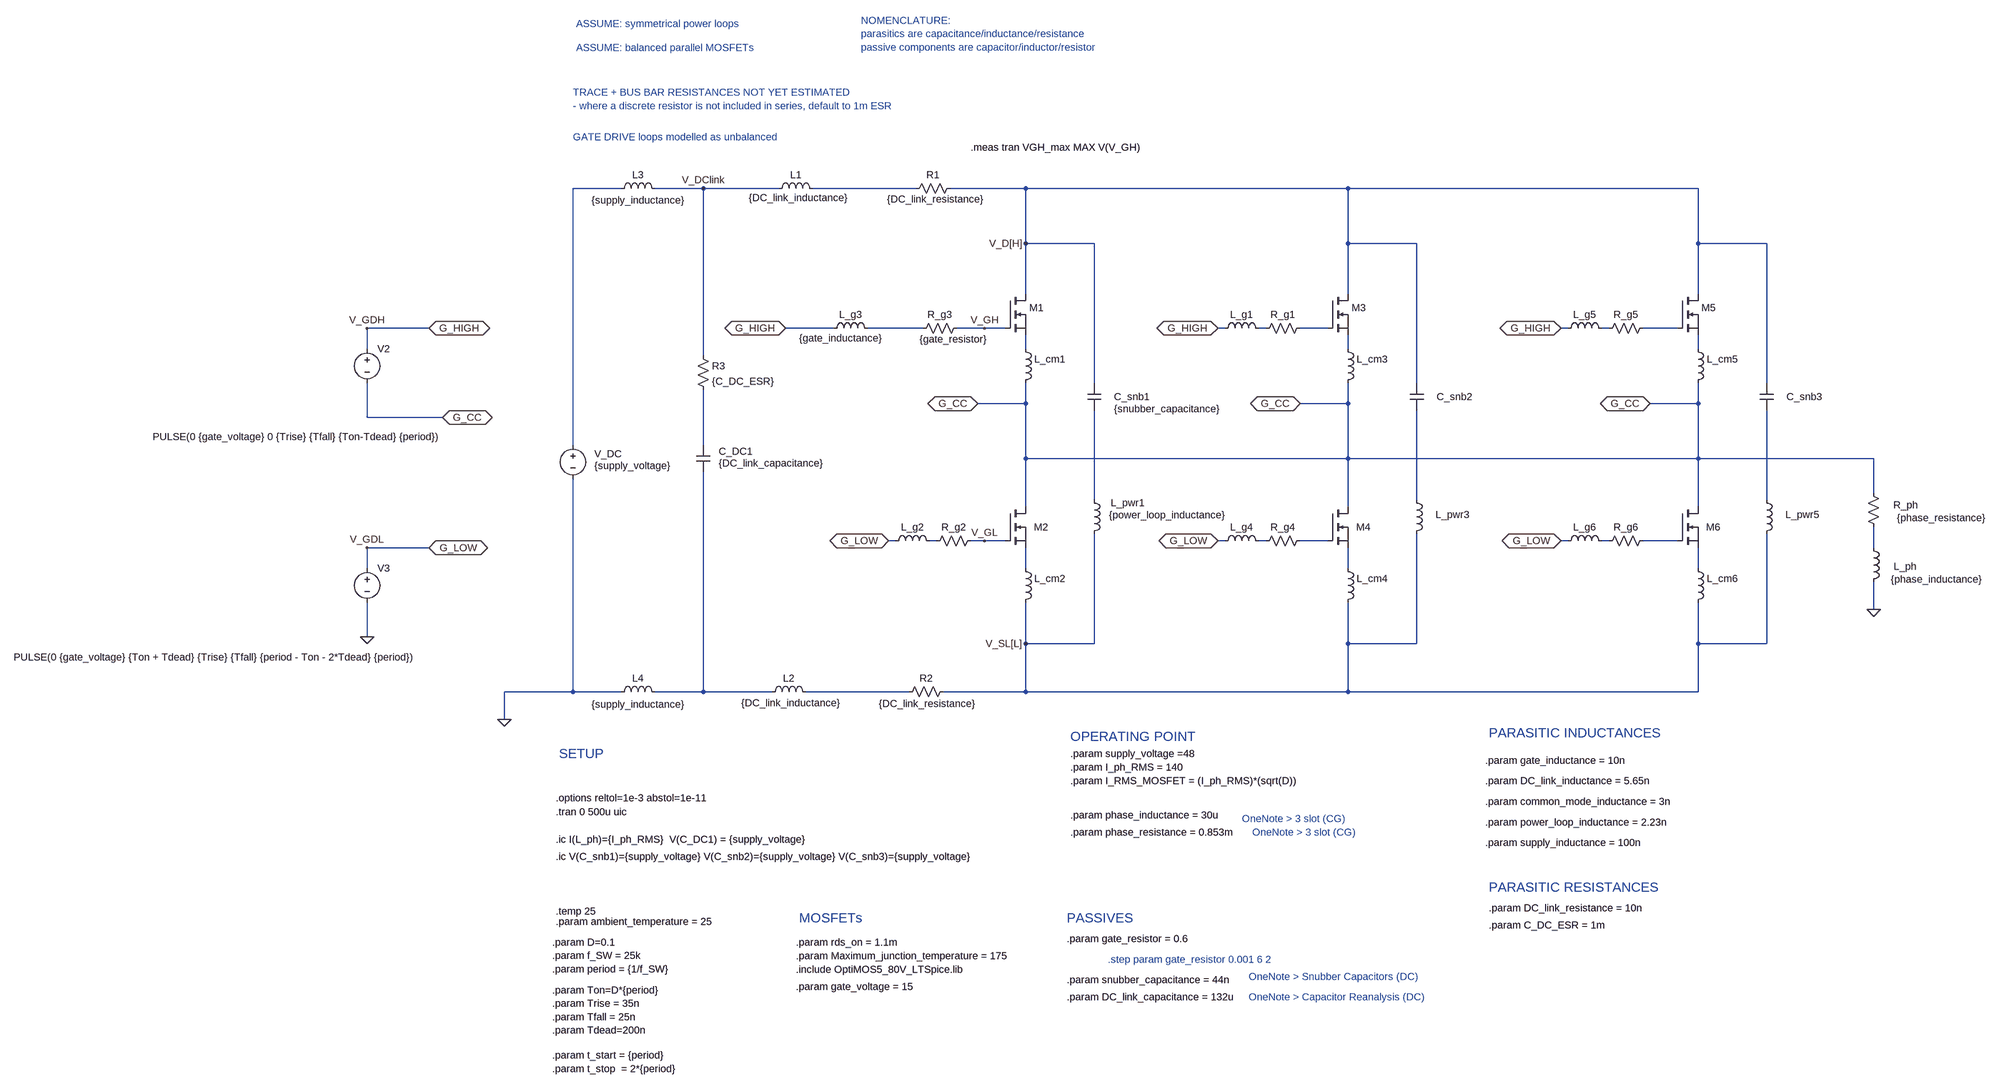
[diagram p0: schematic Inverter_UNBALANCED.asc]
Inverter_UNBALANCED.asc, the LTspice schematic file:
Version 4.1
SHEET 1 7948 3392
WIRE 1136 -928 1024 -928
WIRE 1328 -928 1216 -928
WIRE 1504 -928 1328 -928
WIRE 1824 -928 1584 -928
WIRE 2080 -928 1904 -928
WIRE 2832 -928 2080 -928
WIRE 3648 -928 2832 -928
WIRE 2080 -800 2080 -928
WIRE 2240 -800 2080 -800
WIRE 2832 -800 2832 -928
WIRE 2992 -800 2832 -800
WIRE 3648 -800 3648 -928
WIRE 3808 -800 3648 -800
WIRE 2080 -672 2080 -800
WIRE 2832 -672 2832 -800
WIRE 3648 -672 3648 -800
WIRE 688 -592 544 -592
WIRE 1632 -592 1520 -592
WIRE 1840 -592 1712 -592
WIRE 1984 -592 1920 -592
WIRE 2032 -592 1984 -592
WIRE 2080 -592 2080 -608
WIRE 2544 -592 2528 -592
WIRE 2640 -592 2624 -592
WIRE 2784 -592 2720 -592
WIRE 2832 -592 2832 -608
WIRE 3344 -592 3328 -592
WIRE 3440 -592 3424 -592
WIRE 3600 -592 3520 -592
WIRE 3648 -592 3648 -608
WIRE 544 -544 544 -592
WIRE 2080 -544 2080 -576
WIRE 2832 -544 2832 -576
WIRE 3648 -544 3648 -576
WIRE 1328 -528 1328 -928
WIRE 2240 -464 2240 -800
WIRE 2992 -464 2992 -800
WIRE 3808 -464 3808 -800
WIRE 2080 -416 2080 -464
WIRE 2080 -416 1968 -416
WIRE 2832 -416 2832 -464
WIRE 2832 -416 2720 -416
WIRE 3648 -416 3648 -464
WIRE 3648 -416 3536 -416
WIRE 544 -384 544 -464
WIRE 720 -384 544 -384
WIRE 1024 -320 1024 -928
WIRE 1328 -320 1328 -448
WIRE 2080 -288 2080 -416
WIRE 2832 -288 2832 -416
WIRE 2832 -288 2080 -288
WIRE 3648 -288 3648 -416
WIRE 3648 -288 2832 -288
WIRE 4064 -288 3648 -288
WIRE 4064 -208 4064 -288
WIRE 2240 -192 2240 -400
WIRE 2992 -192 2992 -400
WIRE 3808 -192 3808 -400
WIRE 2080 -176 2080 -288
WIRE 2832 -176 2832 -288
WIRE 3648 -176 3648 -288
WIRE 1776 -96 1760 -96
WIRE 1872 -96 1856 -96
WIRE 1984 -96 1952 -96
WIRE 2032 -96 1984 -96
WIRE 2544 -96 2528 -96
WIRE 2640 -96 2624 -96
WIRE 2784 -96 2720 -96
WIRE 3344 -96 3328 -96
WIRE 3440 -96 3424 -96
WIRE 3600 -96 3520 -96
WIRE 688 -80 544 -80
WIRE 4064 -80 4064 -128
WIRE 544 -32 544 -80
WIRE 2080 -32 2080 -80
WIRE 2832 -32 2832 -80
WIRE 3648 -32 3648 -80
WIRE 4064 64 4064 0
WIRE 544 128 544 48
WIRE 2080 144 2080 48
WIRE 2240 144 2240 -112
WIRE 2240 144 2080 144
WIRE 2832 144 2832 48
WIRE 2992 144 2992 -112
WIRE 2992 144 2832 144
WIRE 3648 144 3648 48
WIRE 3808 144 3808 -112
WIRE 3808 144 3648 144
WIRE 1024 256 1024 -240
WIRE 1024 256 864 256
WIRE 1136 256 1024 256
WIRE 1328 256 1328 -256
WIRE 1328 256 1216 256
WIRE 1488 256 1328 256
WIRE 1808 256 1568 256
WIRE 2080 256 2080 144
WIRE 2080 256 1888 256
WIRE 2832 256 2832 144
WIRE 2832 256 2080 256
WIRE 3648 256 3648 144
WIRE 3648 256 2832 256
WIRE 864 320 864 256
FLAG 544 128 0
FLAG 4064 64 0
FLAG 688 -592 G_HIGH
IOPIN 688 -592 BiDir
FLAG 688 -80 G_LOW
IOPIN 688 -80 BiDir
FLAG 1520 -592 G_HIGH
IOPIN 1520 -592 BiDir
FLAG 1760 -96 G_LOW
IOPIN 1760 -96 BiDir
FLAG 864 320 0
FLAG 1968 -416 G_CC
IOPIN 1968 -416 BiDir
FLAG 720 -384 G_CC
IOPIN 720 -384 BiDir
FLAG 2720 -416 G_CC
IOPIN 2720 -416 BiDir
FLAG 3536 -416 G_CC
IOPIN 3536 -416 BiDir
FLAG 1984 -592 V_GH
FLAG 1984 -96 V_GL
FLAG 2080 -800 V_D[H]
FLAG 2080 144 V_SL[L]
FLAG 544 -592 V_GDH
FLAG 544 -80 V_GDL
FLAG 1328 -928 V_DClink
FLAG 2528 -592 G_HIGH
IOPIN 2528 -592 BiDir
FLAG 2528 -96 G_LOW
IOPIN 2528 -96 BiDir
FLAG 3328 -592 G_HIGH
IOPIN 3328 -592 BiDir
FLAG 3328 -96 G_LOW
IOPIN 3328 -96 BiDir
SYMBOL voltage 1024 -336 R0
WINDOW 3 50 65 Left 2
WINDOW 0 50 37 Left 2
SYMATTR Value {supply_voltage}
SYMATTR InstName V_DC
SYMATTR SpiceLine Rser=0
SYMBOL cap 1312 -320 R0
WINDOW 0 52 15 Left 2
WINDOW 3 52 43 Left 2
SYMATTR InstName C_DC1
SYMATTR Value {DC_link_capacitance}
SYMATTR SpiceLine Rser=0
SYMBOL voltage 544 -560 R0
WINDOW 123 0 0 Left 0
WINDOW 39 0 0 Left 0
WINDOW 3 -500 221 Left 2
SYMATTR Value PULSE(0 {gate_voltage} 0 {Trise} {Tfall} {Ton-Tdead} {period})
SYMATTR InstName V2
SYMBOL voltage 544 -48 R0
WINDOW 123 0 0 Left 0
WINDOW 39 0 0 Left 0
WINDOW 3 -824 223 Left 2
SYMATTR Value PULSE(0 {gate_voltage} {Ton + Tdead} {Trise} {Tfall} {period - Ton - 2*Tdead} {period})
SYMATTR InstName V3
SYMBOL cap 2224 -464 R0
WINDOW 0 62 32 Left 2
WINDOW 3 62 60 Left 2
SYMATTR InstName C_snb1
SYMATTR Value {snubber_capacitance}
SYMATTR SpiceLine Rser=0
SYMBOL res 4080 -112 R180
WINDOW 0 -88 68 Left 2
WINDOW 3 -245 38 Left 2
SYMATTR InstName R_ph
SYMATTR Value {phase_resistance}
SYMBOL ind 4048 -96 R0
WINDOW 0 63 60 Left 2
WINDOW 3 56 90 Left 2
SYMATTR InstName L_ph
SYMATTR Value {phase_inductance}
SYMATTR SpiceLine Rser=1m
SYMBOL nmos 2032 -672 R0
WINDOW 3 56 72 Invisible 2
SYMATTR Value IPTG011N08NM5_L0
SYMATTR InstName M1
SYMATTR Prefix X
SYMBOL nmos 2032 -176 R0
WINDOW 0 67 48 Left 2
WINDOW 3 56 72 Invisible 2
SYMATTR InstName M2
SYMATTR Value IPTG011N08NM5_L0
SYMATTR Prefix X
SYMBOL ind 2064 -560 R0
WINDOW 3 36 80 Invisible 2
SYMATTR Value {common_mode_inductance}
SYMATTR InstName L_cm1
SYMATTR SpiceLine Rser=0
SYMBOL ind 2064 -48 R0
WINDOW 3 36 80 Invisible 2
SYMATTR Value {common_mode_inductance}
SYMATTR InstName L_cm2
SYMATTR SpiceLine Rser=0
SYMBOL ind 2224 -208 R0
WINDOW 0 54 23 Left 2
WINDOW 3 50 52 Left 2
SYMATTR InstName L_pwr1
SYMATTR Value {power_loop_inductance}
SYMATTR SpiceLine Rser=1m
SYMBOL cap 2976 -464 R0
WINDOW 0 62 32 Left 2
WINDOW 3 24 56 Invisible 2
SYMATTR InstName C_snb2
SYMATTR Value {snubber_capacitance}
SYMBOL nmos 2784 -672 R0
WINDOW 3 56 72 Invisible 2
SYMATTR Value IPTG011N08NM5_L0
SYMATTR InstName M3
SYMATTR Prefix X
SYMBOL nmos 2784 -176 R0
WINDOW 0 67 48 Left 2
WINDOW 3 56 72 Invisible 2
SYMATTR InstName M4
SYMATTR Value IPTG011N08NM5_L0
SYMATTR Prefix X
SYMBOL ind 2816 -560 R0
WINDOW 3 36 80 Invisible 2
SYMATTR Value {common_mode_inductance}
SYMATTR InstName L_cm3
SYMATTR SpiceLine Rser=0
SYMBOL ind 2816 -48 R0
WINDOW 3 36 80 Invisible 2
SYMATTR Value {common_mode_inductance}
SYMATTR InstName L_cm4
SYMATTR SpiceLine Rser=0
SYMBOL ind 2976 -208 R0
WINDOW 0 60 51 Left 2
WINDOW 3 36 80 Invisible 2
SYMATTR InstName L_pwr3
SYMATTR Value {power_loop_inductance}
SYMATTR SpiceLine Rser=1m
SYMBOL cap 3792 -464 R0
WINDOW 0 62 32 Left 2
WINDOW 3 24 56 Invisible 2
SYMATTR InstName C_snb3
SYMATTR Value {snubber_capacitance}
SYMBOL nmos 3600 -672 R0
WINDOW 3 56 72 Invisible 2
SYMATTR Value IPTG011N08NM5_L0
SYMATTR InstName M5
SYMATTR Prefix X
SYMBOL nmos 3600 -176 R0
WINDOW 0 67 48 Left 2
WINDOW 3 56 72 Invisible 2
SYMATTR InstName M6
SYMATTR Value IPTG011N08NM5_L0
SYMATTR Prefix X
SYMBOL ind 3632 -560 R0
WINDOW 3 36 80 Invisible 2
SYMATTR Value {common_mode_inductance}
SYMATTR InstName L_cm5
SYMATTR SpiceLine Rser=0
SYMBOL ind 3632 -48 R0
WINDOW 3 36 80 Invisible 2
SYMATTR Value {common_mode_inductance}
SYMATTR InstName L_cm6
SYMATTR SpiceLine Rser=0
SYMBOL ind 3792 -208 R0
WINDOW 0 60 51 Left 2
WINDOW 3 36 80 Invisible 2
SYMATTR InstName L_pwr5
SYMATTR Value {power_loop_inductance}
SYMATTR SpiceLine Rser=1m
SYMBOL res 1856 -80 R270
WINDOW 0 32 56 VTop 2
WINDOW 3 0 56 Invisible 2
SYMATTR InstName R_g2
SYMATTR Value {gate_resistor}
SYMBOL ind 1760 -80 R270
WINDOW 0 32 56 VTop 2
WINDOW 3 5 56 Invisible 2
SYMATTR InstName L_g2
SYMATTR Value {gate_inductance}
SYMATTR SpiceLine Rser=0
SYMBOL ind 1488 -912 R270
WINDOW 0 32 56 VTop 2
WINDOW 3 -21 62 VTop 2
SYMATTR InstName L1
SYMATTR Value {DC_link_inductance}
SYMATTR SpiceLine Rser=0
SYMBOL ind 1472 272 R270
WINDOW 0 32 56 VTop 2
WINDOW 3 -26 60 VTop 2
SYMATTR InstName L2
SYMATTR Value {DC_link_inductance}
SYMATTR SpiceLine Rser=0
SYMBOL ind 1616 -576 R270
WINDOW 0 32 56 VTop 2
WINDOW 3 -23 33 VTop 2
SYMATTR InstName L_g3
SYMATTR Value {gate_inductance}
SYMATTR SpiceLine Rser=0
SYMBOL res 1824 -576 R270
WINDOW 0 32 56 VTop 2
WINDOW 3 -25 87 VTop 2
SYMATTR InstName R_g3
SYMATTR Value {gate_resistor}
SYMBOL res 1920 -944 R90
WINDOW 0 0 56 VBottom 2
WINDOW 3 57 51 VBottom 2
SYMATTR InstName R1
SYMATTR Value {DC_link_resistance}
SYMBOL res 1904 240 R90
WINDOW 0 0 56 VBottom 2
WINDOW 3 59 54 VBottom 2
SYMATTR InstName R2
SYMATTR Value {DC_link_resistance}
SYMBOL ind 2528 -576 R270
WINDOW 0 32 56 VTop 2
WINDOW 3 5 56 Invisible 2
SYMATTR InstName L_g1
SYMATTR Value {gate_inductance}
SYMATTR SpiceLine Rser=0
SYMBOL res 2624 -576 R270
WINDOW 0 32 56 VTop 2
WINDOW 3 0 56 Invisible 2
SYMATTR InstName R_g1
SYMATTR Value {gate_resistor}
SYMBOL res 2624 -80 R270
WINDOW 0 32 56 VTop 2
WINDOW 3 0 56 Invisible 2
SYMATTR InstName R_g4
SYMATTR Value {gate_resistor}
SYMBOL ind 2528 -80 R270
WINDOW 0 32 56 VTop 2
WINDOW 3 5 56 Invisible 2
SYMATTR InstName L_g4
SYMATTR Value {gate_inductance}
SYMATTR SpiceLine Rser=0
SYMBOL ind 3328 -576 R270
WINDOW 0 32 56 VTop 2
WINDOW 3 5 56 Invisible 2
SYMATTR InstName L_g5
SYMATTR Value {gate_inductance}
SYMATTR SpiceLine Rser=0
SYMBOL res 3424 -576 R270
WINDOW 0 32 56 VTop 2
WINDOW 3 0 56 Invisible 2
SYMATTR InstName R_g5
SYMATTR Value {gate_resistor}
SYMBOL res 3424 -80 R270
WINDOW 0 32 56 VTop 2
WINDOW 3 0 56 Invisible 2
SYMATTR InstName R_g6
SYMATTR Value {gate_resistor}
SYMBOL ind 3328 -80 R270
WINDOW 0 32 56 VTop 2
WINDOW 3 5 56 Invisible 2
SYMATTR InstName L_g6
SYMATTR Value {gate_inductance}
SYMATTR SpiceLine Rser=0
SYMBOL ind 1120 -912 R270
WINDOW 0 32 56 VTop 2
WINDOW 3 -27 56 VTop 2
SYMATTR InstName L3
SYMATTR Value {supply_inductance}
SYMATTR SpiceLine Rser=1m
SYMBOL ind 1120 272 R270
WINDOW 0 32 56 VTop 2
WINDOW 3 -29 56 VTop 2
SYMATTR InstName L4
SYMATTR Value {supply_inductance}
SYMATTR SpiceLine Rser=1m
SYMBOL res 1312 -544 R0
SYMATTR InstName R3
SYMATTR Value {C_DC_ESR}
TEXT 976 840 Left 2 !.param D=0.1\n.param f_SW = 25k\n.param period = {1/f_SW}
TEXT 984 504 Left 2 !.options reltol=1e-3 abstol=1e-11
TEXT 1544 904 Left 2 !.include OptiMOS5_80V_LTSpice.lib
TEXT 984 768 Left 2 !.temp 25
TEXT 2176 928 Left 2 !.param snubber_capacitance = 44n
TEXT 2176 968 Left 2 !.param DC_link_capacitance = 132u
TEXT 2184 400 Left 2 !.param supply_voltage =48
TEXT 2184 584 Left 2 !.param phase_resistance = 0.853m
TEXT 2184 544 Left 2 !.param phase_inductance = 30u
TEXT 976 1104 Left 2 !.param t_start = {period}\n.param t_stop  = 2*{period}
TEXT 2184 432 Left 2 !.param I_ph_RMS = 140
TEXT 2184 464 Left 2 !.param I_RMS_MOSFET = (I_ph_RMS)*(sqrt(D))
TEXT 984 792 Left 2 !.param ambient_temperature = 25
TEXT 1544 872 Left 2 !.param Maximum_junction_temperature = 175
TEXT 1544 840 Left 2 !.param rds_on = 1.1m
TEXT 984 600 Left 2 !.ic I(L_ph)={I_ph_RMS}  V(C_DC1) = {supply_voltage}
TEXT 3152 512 Left 2 !.param common_mode_inductance = 3n
TEXT 3152 560 Left 2 !.param power_loop_inductance = 2.23n
TEXT 2176 832 Left 2 !.param gate_resistor = 0.6
TEXT 3152 416 Left 2 !.param gate_inductance = 10n
TEXT 992 400 Left 3 ;SETUP
TEXT 1552 784 Left 3 ;MOSFETs
TEXT 2184 360 Left 3 ;OPERATING POINT
TEXT 3160 352 Left 3 ;PARASITIC INDUCTANCES
TEXT 2176 784 Left 3 ;PASSIVES
TEXT 1952 -1024 Left 2 !.meas tran VGH_max MAX V(V_GH)
TEXT 1544 944 Left 2 !.param gate_voltage = 15
TEXT 2272 880 Left 2 ;.step param gate_resistor 0.001 6 2
TEXT 3152 464 Left 2 !.param DC_link_inductance = 5.65n
TEXT 1032 -1312 Left 2 ;ASSUME: symmetrical power loops
TEXT 1024 -1152 Left 2 ;TRACE + BUS BAR RESISTANCES NOT YET ESTIMATED\n- where a discrete resistor is not included in series, default to 1m ESR
TEXT 1032 -1256 Left 2 ;ASSUME: balanced parallel MOSFETs
TEXT 976 952 Left 2 !.param Ton=D*{period}\n.param Trise = 35n\n.param Tfall = 25n\n.param Tdead=200n
TEXT 984 536 Left 2 !.tran 0 500u uic
TEXT 984 640 Left 2 !.ic V(C_snb1)={supply_voltage} V(C_snb2)={supply_voltage} V(C_snb3)={supply_voltage}
TEXT 1024 -1048 Left 2 ;GATE DRIVE loops modelled as unbalanced
TEXT 3152 608 Left 2 !.param supply_inductance = 100n
TEXT 3160 712 Left 3 ;PARASITIC RESISTANCES
TEXT 3160 760 Left 2 !.param DC_link_resistance = 10n
TEXT 3160 800 Left 2 !.param C_DC_ESR = 1m
TEXT 2600 968 Left 2 ;OneNote > Capacitor Reanalysis (DC)
TEXT 2600 920 Left 2 ;OneNote > Snubber Capacitors (DC)
TEXT 2584 552 Left 2 ;OneNote > 3 slot (CG)
TEXT 2608 584 Left 2 ;OneNote > 3 slot (CG)
TEXT 1696 -1320 Left 2 ;NOMENCLATURE: \nparasitics are capacitance/inductance/resistance\npassive components are capacitor/inductor/resistor

The netlist it stands for:
* Inverter_UNBALANCED.asc
V_DC N001 0 {supply_voltage} Rser=0
C_DC1 N014 N027 {DC_link_capacitance} Rser=0
V2 V_GDH G_CC PULSE(0 {gate_voltage} 0 {Trise} {Tfall} {Ton-Tdead} {period})
V3 V_GDL 0 PULSE(0 {gate_voltage} {Ton + Tdead} {Trise} {Tfall} {period - Ton - 2*Tdead} {period})
C_snb1 V_D[H] N015 {snubber_capacitance} Rser=0
R_ph N023 G_CC {phase_resistance}
L_ph N023 0 {phase_inductance} Rser=1m
X§M1 V_D[H] V_GH N011 IPTG011N08NM5_L0  ; pins D G S
X§M2 G_CC V_GL N024 IPTG011N08NM5_L0  ; pins D G S
L_cm1 N011 G_CC {common_mode_inductance} Rser=0
L_cm2 N024 V_SL[L] {common_mode_inductance} Rser=0
L_pwr1 N015 V_SL[L] {power_loop_inductance} Rser=1m
C_snb2 V_D[H] N016 {snubber_capacitance}
X§M3 V_D[H] N006 N012 IPTG011N08NM5_L0  ; pins D G S
X§M4 G_CC N020 N025 IPTG011N08NM5_L0  ; pins D G S
L_cm3 N012 G_CC {common_mode_inductance} Rser=0
L_cm4 N025 V_SL[L] {common_mode_inductance} Rser=0
L_pwr3 N016 V_SL[L] {power_loop_inductance} Rser=1m
C_snb3 V_D[H] N017 {snubber_capacitance}
X§M5 V_D[H] N009 N013 IPTG011N08NM5_L0  ; pins D G S
X§M6 G_CC N022 N026 IPTG011N08NM5_L0  ; pins D G S
L_cm5 N013 G_CC {common_mode_inductance} Rser=0
L_cm6 N026 V_SL[L] {common_mode_inductance} Rser=0
L_pwr5 N017 V_SL[L] {power_loop_inductance} Rser=1m
R_g2 N018 V_GL {gate_resistor}
L_g2 V_GDL N018 {gate_inductance} Rser=0
L1 V_DClink N002 {DC_link_inductance} Rser=0
L2 N027 N028 {DC_link_inductance} Rser=0
L_g3 V_GDH N003 {gate_inductance} Rser=0
R_g3 N003 V_GH {gate_resistor}
R1 V_D[H] N002 {DC_link_resistance}
R2 V_SL[L] N028 {DC_link_resistance}
L_g1 V_GDH N005 {gate_inductance} Rser=0
R_g1 N005 N006 {gate_resistor}
R_g4 N019 N020 {gate_resistor}
L_g4 V_GDL N019 {gate_inductance} Rser=0
L_g5 V_GDH N008 {gate_inductance} Rser=0
R_g5 N008 N009 {gate_resistor}
R_g6 N021 N022 {gate_resistor}
L_g6 V_GDL N021 {gate_inductance} Rser=0
L3 N001 V_DClink {supply_inductance} Rser=1m
L4 0 N027 {supply_inductance} Rser=1m
R3 V_DClink N014 {C_DC_ESR}
.param D=0.1
.param f_SW = 25k
.param period = {1/f_SW}
.options reltol=1e-3 abstol=1e-11
.include OptiMOS5_80V_LTSpice.lib
.temp 25
.param snubber_capacitance = 44n
.param DC_link_capacitance = 132u
.param supply_voltage =48
.param phase_resistance = 0.853m
.param phase_inductance = 30u
.param t_start = {period}
.param t_stop  = 2*{period}
.param I_ph_RMS = 140
.param I_RMS_MOSFET = (I_ph_RMS)*(sqrt(D))
.param ambient_temperature = 25
.param Maximum_junction_temperature = 175
.param rds_on = 1.1m
.ic I(L_ph)={I_ph_RMS}  V(C_DC1) = {supply_voltage}
.param common_mode_inductance = 3n
.param power_loop_inductance = 2.23n
.param gate_resistor = 0.6
.param gate_inductance = 10n
* SETUP
* MOSFETs
* OPERATING POINT
* PARASITIC INDUCTANCES
* PASSIVES
.meas tran VGH_max MAX V(V_GH)
.param gate_voltage = 15
* .step param gate_resistor 0.001 6 2
.param DC_link_inductance = 5.65n
* ASSUME: symmetrical power loops
* TRACE + BUS BAR RESISTANCES NOT YET ESTIMATED
* - where a discrete resistor is not included in series, default to 1m ESR
* ASSUME: balanced parallel MOSFETs
.param Ton=D*{period}
.param Trise = 35n
.param Tfall = 25n
.param Tdead=200n
.tran 0 500u uic
.ic V(C_snb1)={supply_voltage} V(C_snb2)={supply_voltage} V(C_snb3)={supply_voltage}
* GATE DRIVE loops modelled as unbalanced
.param supply_inductance = 100n
* PARASITIC RESISTANCES
.param DC_link_resistance = 10n
.param C_DC_ESR = 1m
* OneNote > Capacitor Reanalysis (DC)
* OneNote > Snubber Capacitors (DC)
* OneNote > 3 slot (CG)
* OneNote > 3 slot (CG)
* NOMENCLATURE:
* parasitics are capacitance/inductance/resistance
* passive components are capacitor/inductor/resistor
.backanno
.end